# EAGLE schematic yoocnc_grbl (EAGLE 6.5.0)
DATABASE: d:/program files/eagle/parts_db/digikey_parts.txt

## Sheet 1 of 6
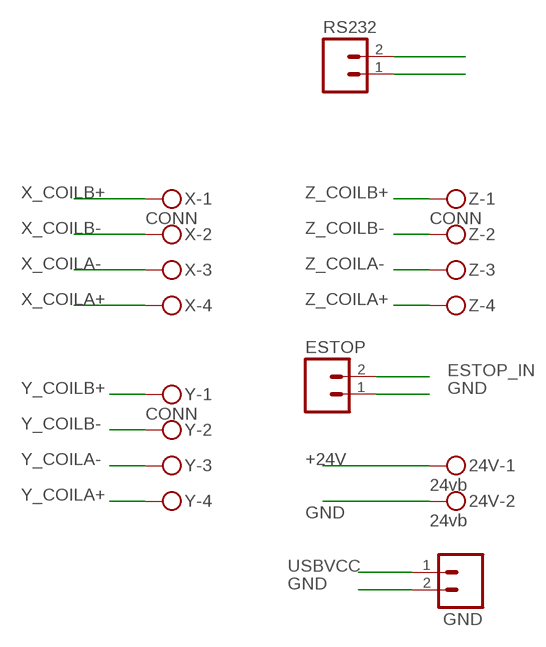
[diagram p0: schematic, sheet 1]

### Parts
24V  24vb  MKDSN1,5/2-5,08  [MKDSN1,5/2-5,08]
ESTOP  M02LOCK_LONGPADS  [1X02_LOCK_LONGPADS]
GND  M02LOCK_LONGPADS  [1X02_LOCK_LONGPADS]
RS232  M02LOCK_LONGPADS  [1X02_LOCK_LONGPADS]
X  CONN  MKDSN1,5/4-5,08  [MKDSN1,5/4-5,08]
Y  CONN  MKDSN1,5/4-5,08  [MKDSN1,5/4-5,08]
Z  CONN  MKDSN1,5/4-5,08  [MKDSN1,5/4-5,08]

### Nets
+24V [power]: 24V.1 ; also sheet 2
ESTOP_IN: ESTOP.2 ; also sheet 6
GND [power]: 24V.2 ESTOP.1 GND.2 ; also sheet 2,3,4,5,6
RXD2: RS232.1 ; also sheet 6
TXD2: RS232.2 ; also sheet 6
USBVCC [usbvcc]: GND.1 ; also sheet 2,5,6
X_COILA+ [gnd]: X.4 ; also sheet 2
X_COILA- [gnd]: X.3 ; also sheet 2
X_COILB+ [gnd]: X.1 ; also sheet 2
X_COILB- [gnd]: X.2 ; also sheet 2
Y_COILA+ [gnd]: Y.4 ; also sheet 3
Y_COILA- [gnd]: Y.3 ; also sheet 3
Y_COILB+ [gnd]: Y.1 ; also sheet 3
Y_COILB- [gnd]: Y.2 ; also sheet 3
Z_COILA+ [gnd]: Z.4 ; also sheet 4
Z_COILA- [gnd]: Z.3 ; also sheet 4
Z_COILB+ [gnd]: Z.1 ; also sheet 4
Z_COILB- [gnd]: Z.2 ; also sheet 4

## Sheet 2 of 6
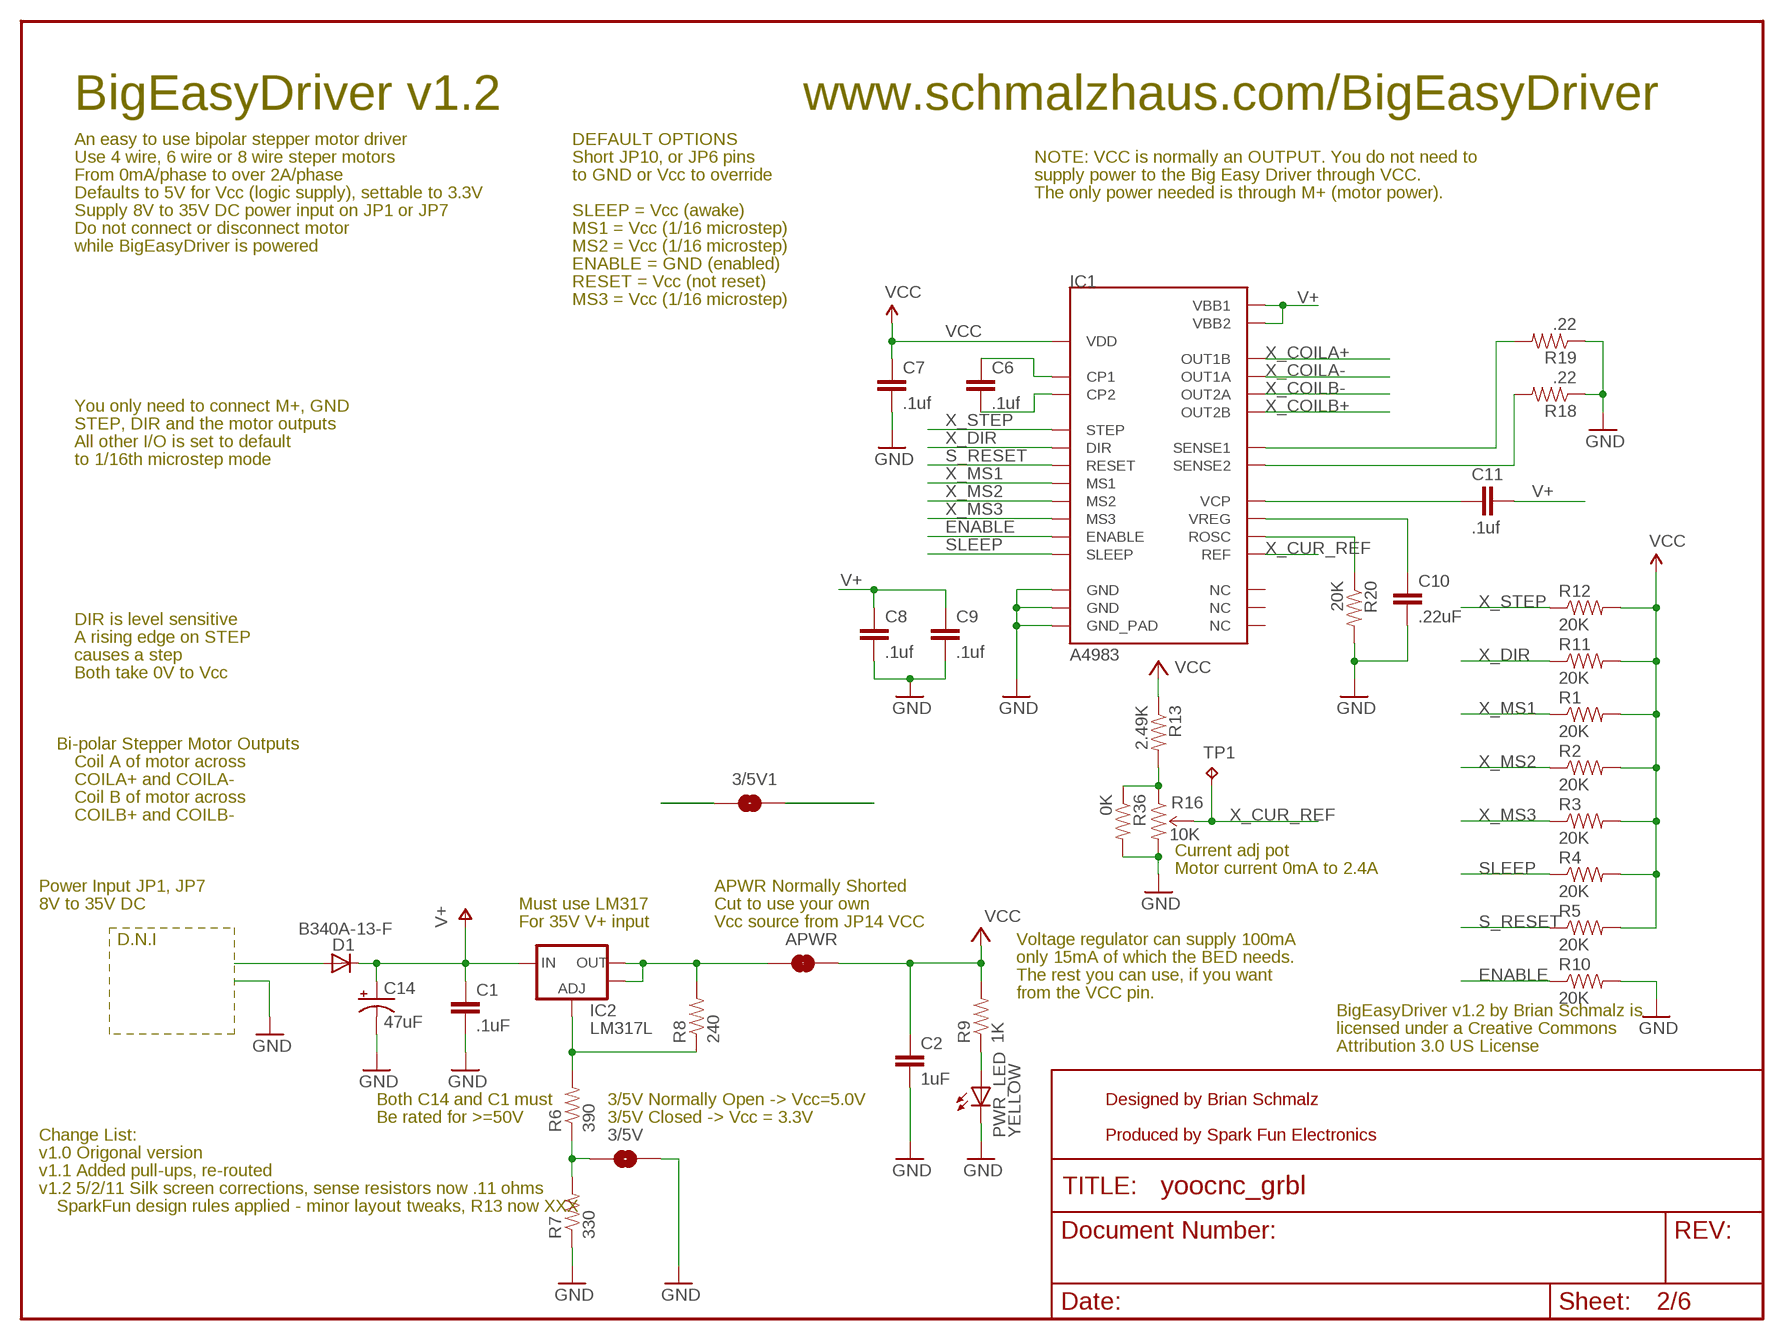
[diagram p1: schematic, sheet 2]

### Parts
3/5V  SOLDERJUMPERNO  [SJ_2S-NO]
3/5V1  SOLDERJUMPERNO  [SJ_2S-NO]
APWR  SOLDERJUMPERTRACE  [SJ_2S-TRACE]
C1  .1uF  CAP1206  [1206]
C2  1uF  CAP0402-CAP  [0402-CAP]
C6  .1uf  CAP0402-CAP  [0402-CAP]
C7  .1uf  CAP0402-CAP  [0402-CAP]
C8  .1uf  CAP0402-CAP  [0402-CAP]
C9  .1uf  CAP0402-CAP  [0402-CAP]
C10  .22uF  CAP0402-CAP  [0402-CAP]
C11  .1uf  CAP0402-CAP  [0402-CAP]
C14  47uF  CAP_POLD  [PANASONIC_D]
D1  B340A-13-F  DIODE-DO-214AC  [DO-214AC]
IC1  A4983  [QFN-28-5MM]
IC2  LM317L  SPARKFUN03_30_09_V_REG_317SOT89SOT89  [SCHMALZHAUS_SOT89]
PWR_LED  YELLOW  LED0603  [LED-0603]
R1  20K  RESISTOR0402-RES  [0402-RES]
R2  20K  RESISTOR0402-RES  [0402-RES]
R3  20K  RESISTOR0402-RES  [0402-RES]
R4  20K  RESISTOR0402-RES  [0402-RES]
R5  20K  RESISTOR0402-RES  [0402-RES]
R6  390  RESISTOR0402-RES  [0402-RES]
R7  330  RESISTOR0402-RES  [0402-RES]
R8  240  RESISTOR0402-RES  [0402-RES]
R9  1K  RESISTOR0402-RES  [0402-RES]
R10  20K  RESISTOR0402-RES  [0402-RES]
R11  20K  RESISTOR0402-RES  [0402-RES]
R12  20K  RESISTOR0402-RES  [0402-RES]
R13  2.49K  RESISTOR0402-RES  [0402-RES]
R16  10K  TRIMPOT-PTH-KNOB  [3386U]
R18  .22  RESISTOR2010  [R2010]
R19  .22  RESISTOR2010  [R2010]
R20  20K  RESISTOR0402-RES  [0402-RES]
R36  0K  RESISTOR0402-RES  [0402-RES]
TP1  TPPAD1-13  [P1-13]

### Nets
+24V [power]: D1.A ; also sheet 1
ENABLE: IC1.P$2(ENABLE) R10.1 ; also sheet 3,4,6
GND [power]: 3/5V.2 C1.2 C2.2 C7.2 C8.2 C9.2 C10.2 C14.- IC1.P$3(GND) IC1.P$18(GND) IC1.P$29(GND_PAD) PWR_LED.C R7.1 R10.2 R16.3(CW) R18.1 R19.1 R20.2 R36.2 ; also sheet 1,3,4,5,6
N$2: PWR_LED.A R9.1
N$3: R13.2 R16.1(CCW) R36.1
N$4: 3/5V.1 R6.1 R7.2
N$6: IC2.ADJ R6.2 R8.1
N$8: C6.1 IC1.P$4(CP1)
N$9: C6.2 IC1.P$5(CP2)
N$19: IC1.P$13(ROSC) R20.1
N$20: C10.1 IC1.P$8(VREG)
N$21: C11.1 IC1.P$6(VCP)
N$31: IC1.P$27(SENSE2) R18.2
N$32: IC1.P$23(SENSE1) R19.2
S_RESET: IC1.P$12(RESET) R5.1 ; also sheet 3,4,6
SLEEP: IC1.P$14(SLEEP) R4.1 ; also sheet 3,4,6
USBVCC [usbvcc]: 3/5V1.1 ; also sheet 1,5,6
V+ [power]: C1.1 C8.1 C9.1 C11.2 C14.+ D1.C IC1.P$22(VBB1) IC1.P$28(VBB2) IC2.IN ; also sheet 3,4
VCC: 3/5V1.2 APWR.2 C2.1 C7.1 IC1.P$15(VDD) R1.2 R2.2 R3.2 R4.2 R5.2 R9.2 R11.2 R12.2 R13.1 ; also sheet 3,4
X_5V_ALT [power]: APWR.1 IC2.OUT IC2.OUT@1(OUT) R8.2
X_COILA+ [gnd]: IC1.P$21(OUT1B) ; also sheet 1
X_COILA- [gnd]: IC1.P$24(OUT1A) ; also sheet 1
X_COILB+ [gnd]: IC1.P$1(OUT2B) ; also sheet 1
X_COILB- [gnd]: IC1.P$26(OUT2A) ; also sheet 1
X_CUR_REF: IC1.P$17(REF) R16.2(WIPER) TP1.TP
X_DIR: IC1.P$19(DIR) R11.1 ; also sheet 6
X_MS1: IC1.P$9(MS1) R1.1 ; also sheet 6
X_MS2: IC1.P$10(MS2) R2.1 ; also sheet 6
X_MS3: IC1.P$11(MS3) R3.1 ; also sheet 6
X_STEP: IC1.P$16(STEP) R12.1 ; also sheet 6
Unconnected: IC1.P$7(NC) IC1.P$20(NC) IC1.P$25(NC)

### Notes on the sheet
- BigEasyDriver v1.2 | www.schmalzhaus.com/BigEasyDriver
- An easy to use bipolar stepper motor driver | DEFAULT OPTIONS
- Use 4 wire, 6 wire or 8 wire steper motors | Short JP10, or JP6 pins | NOTE: VCC is normally an OUTPUT. You do not need to
- From 0mA/phase to over 2A/phase | to GND or Vcc to override | supply power to the Big Easy Driver through VCC.
- Defaults to 5V for Vcc (logic supply), settable to 3.3V | The only power needed is through M+ (motor power).
- Supply 8V to 35V DC power input on JP1 or JP7 | SLEEP = Vcc (awake)
- Do not connect or disconnect motor | MS1 = Vcc (1/16 microstep)
- while BigEasyDriver is powered | MS2 = Vcc (1/16 microstep)
- ENABLE = GND (enabled)
- RESET = Vcc (not reset)
- MS3 = Vcc (1/16 microstep)
- You only need to connect M+, GND
- STEP, DIR and the motor outputs
- All other I/O is set to default
- to 1/16th microstep mode
- DIR is level sensitive
- A rising edge on STEP
- causes a step
- Both take 0V to Vcc
- Bi-polar Stepper Motor Outputs
- Coil A of motor across
- COILA+ and COILA-
- Coil B of motor across
- COILB+ and COILB-
- Current adj pot
- Motor current 0mA to 2.4A
- Power Input JP1, JP7 | APWR Normally Shorted
- 8V to 35V DC | Must use LM317 | Cut to use your own
- For 35V V+ input | Vcc source from JP14 VCC
- D.N.I | Voltage regulator can supply 100mA
- only 15mA of which the BED needs.
- The rest you can use, if you want
- from the VCC pin.
- BigEasyDriver v1.2 by Brian Schmalz is
- licensed under a Creative Commons
- Attribution 3.0 US License
- Both C14 and C1 must | 3/5V Normally Open -> Vcc=5.0V | Designed by Brian Schmalz
- Be rated for >=50V | 3/5V Closed -> Vcc = 3.3V
- Change List: | Produced by Spark Fun Electronics
- v1.0 Origonal version
- v1.1 Added pull-ups, re-routed
- v1.2 5/2/11 Silk screen corrections, sense resistors now .11 ohms
- SparkFun design rules applied - minor layout tweaks, R13 now XXX

## Sheet 3 of 6
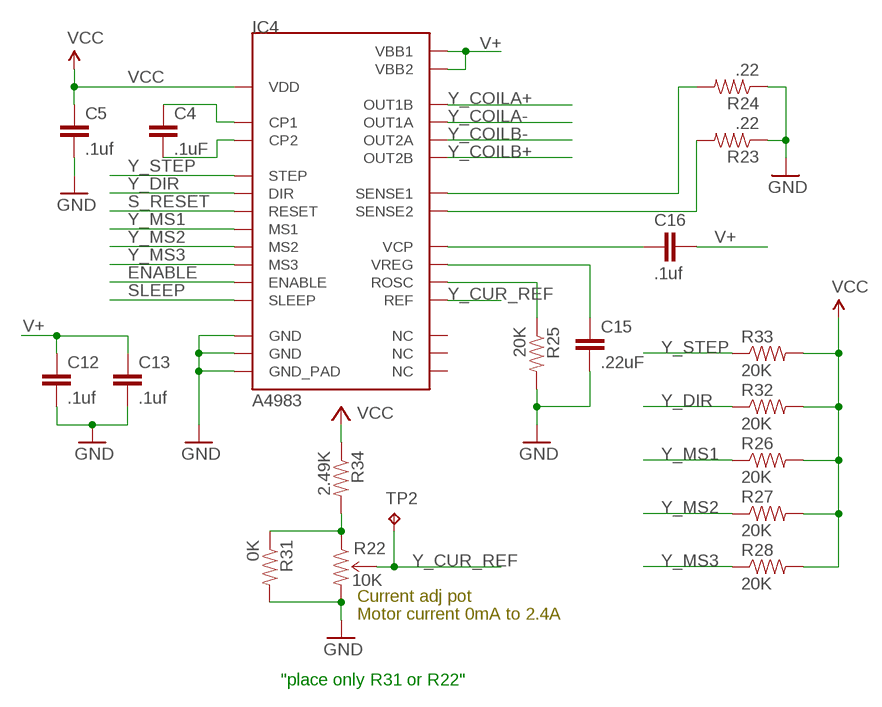
[diagram p2: schematic, sheet 3]

### Parts
C4  .1uF  CAP0402-CAP  [0402-CAP]
C5  .1uf  CAP0402-CAP  [0402-CAP]
C12  .1uf  CAP0402-CAP  [0402-CAP]
C13  .1uf  CAP0402-CAP  [0402-CAP]
C15  .22uF  CAP0402-CAP  [0402-CAP]
C16  .1uf  CAP0402-CAP  [0402-CAP]
IC4  A4983  [QFN-28-5MM]
R22  10K  TRIMPOT-PTH-KNOB  [3386U]
R23  .22  RESISTOR2010  [R2010]
R24  .22  RESISTOR2010  [R2010]
R25  20K  RESISTOR0402-RES  [0402-RES]
R26  20K  RESISTOR0402-RES  [0402-RES]
R27  20K  RESISTOR0402-RES  [0402-RES]
R28  20K  RESISTOR0402-RES  [0402-RES]
R31  0K  RESISTOR0402-RES  [0402-RES]
R32  20K  RESISTOR0402-RES  [0402-RES]
R33  20K  RESISTOR0402-RES  [0402-RES]
R34  2.49K  RESISTOR0402-RES  [0402-RES]
TP2  TPPAD1-13  [P1-13]

### Nets
ENABLE: IC4.P$2(ENABLE) ; also sheet 2,4,6
GND [power]: C5.2 C12.2 C13.2 C15.2 IC4.P$3(GND) IC4.P$18(GND) IC4.P$29(GND_PAD) R22.3(CW) R23.1 R24.1 R25.2 R31.2 ; also sheet 1,2,4,5,6
N$11: IC4.P$27(SENSE2) R23.2
N$12: IC4.P$23(SENSE1) R24.2
N$13: C4.1 IC4.P$4(CP1)
N$14: C4.2 IC4.P$5(CP2)
N$15: IC4.P$13(ROSC) R25.1
N$16: C15.1 IC4.P$8(VREG)
N$17: C16.1 IC4.P$6(VCP)
N$22: R22.1(CCW) R31.1 R34.2
S_RESET: IC4.P$12(RESET) ; also sheet 2,4,6
SLEEP: IC4.P$14(SLEEP) ; also sheet 2,4,6
V+ [power]: C12.1 C13.1 C16.2 IC4.P$22(VBB1) IC4.P$28(VBB2) ; also sheet 2,4
VCC: C5.1 IC4.P$15(VDD) R26.2 R27.2 R28.2 R32.2 R33.2 R34.1 ; also sheet 2,4
Y_COILA+ [gnd]: IC4.P$21(OUT1B) ; also sheet 1
Y_COILA- [gnd]: IC4.P$24(OUT1A) ; also sheet 1
Y_COILB+ [gnd]: IC4.P$1(OUT2B) ; also sheet 1
Y_COILB- [gnd]: IC4.P$26(OUT2A) ; also sheet 1
Y_CUR_REF: IC4.P$17(REF) R22.2(WIPER) TP2.TP
Y_DIR: IC4.P$19(DIR) R32.1 ; also sheet 6
Y_MS1: IC4.P$9(MS1) R26.1 ; also sheet 6
Y_MS2: IC4.P$10(MS2) R27.1 ; also sheet 6
Y_MS3: IC4.P$11(MS3) R28.1 ; also sheet 6
Y_STEP: IC4.P$16(STEP) R33.1 ; also sheet 6
Unconnected: IC4.P$7(NC) IC4.P$20(NC) IC4.P$25(NC)

### Notes on the sheet
- Current adj pot
- Motor current 0mA to 2.4A
- "place only R31 or R22"

## Sheet 4 of 6
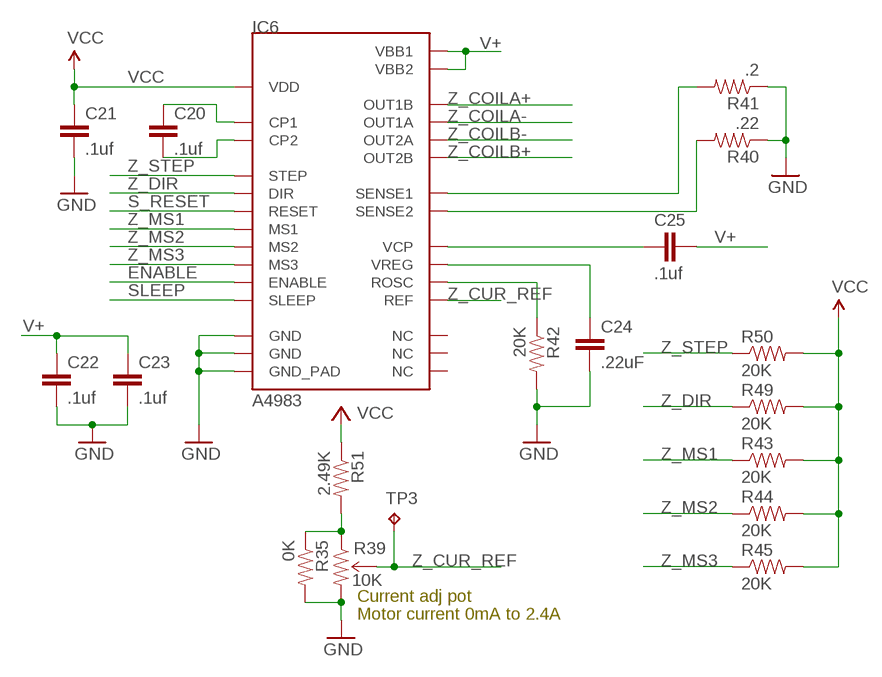
[diagram p3: schematic, sheet 4]

### Parts
C20  .1uf  CAP0402-CAP  [0402-CAP]
C21  .1uf  CAP0402-CAP  [0402-CAP]
C22  .1uf  CAP0402-CAP  [0402-CAP]
C23  .1uf  CAP0402-CAP  [0402-CAP]
C24  .22uF  CAP0402-CAP  [0402-CAP]
C25  .1uf  CAP0402-CAP  [0402-CAP]
IC6  A4983  [QFN-28-5MM]
R35  0K  RESISTOR0402-RES  [0402-RES]
R39  10K  TRIMPOT-PTH-KNOB  [3386U]
R40  .22  RESISTOR2010  [R2010]
R41  .2  RESISTOR2010  [R2010]
R42  20K  RESISTOR0402-RES  [0402-RES]
R43  20K  RESISTOR0402-RES  [0402-RES]
R44  20K  RESISTOR0402-RES  [0402-RES]
R45  20K  RESISTOR0402-RES  [0402-RES]
R49  20K  RESISTOR0402-RES  [0402-RES]
R50  20K  RESISTOR0402-RES  [0402-RES]
R51  2.49K  RESISTOR0402-RES  [0402-RES]
TP3  TPPAD1-13  [P1-13]

### Nets
ENABLE: IC6.P$2(ENABLE) ; also sheet 2,3,6
GND [power]: C21.2 C22.2 C23.2 C24.2 IC6.P$3(GND) IC6.P$18(GND) IC6.P$29(GND_PAD) R35.2 R39.3(CW) R40.1 R41.1 R42.2 ; also sheet 1,2,3,5,6
N$26: IC6.P$27(SENSE2) R40.2
N$27: IC6.P$23(SENSE1) R41.2
N$28: C20.1 IC6.P$4(CP1)
N$29: C20.2 IC6.P$5(CP2)
N$30: IC6.P$13(ROSC) R42.1
N$33: C24.1 IC6.P$8(VREG)
N$34: C25.1 IC6.P$6(VCP)
N$36: R35.1 R39.1(CCW) R51.2
S_RESET: IC6.P$12(RESET) ; also sheet 2,3,6
SLEEP: IC6.P$14(SLEEP) ; also sheet 2,3,6
V+ [power]: C22.1 C23.1 C25.2 IC6.P$22(VBB1) IC6.P$28(VBB2) ; also sheet 2,3
VCC: C21.1 IC6.P$15(VDD) R43.2 R44.2 R45.2 R49.2 R50.2 R51.1 ; also sheet 2,3
Z_COILA+ [gnd]: IC6.P$21(OUT1B) ; also sheet 1
Z_COILA- [gnd]: IC6.P$24(OUT1A) ; also sheet 1
Z_COILB+ [gnd]: IC6.P$1(OUT2B) ; also sheet 1
Z_COILB- [gnd]: IC6.P$26(OUT2A) ; also sheet 1
Z_CUR_REF: IC6.P$17(REF) R39.2(WIPER) TP3.TP
Z_DIR: IC6.P$19(DIR) R49.1 ; also sheet 6
Z_MS1: IC6.P$9(MS1) R43.1 ; also sheet 6
Z_MS2: IC6.P$10(MS2) R44.1 ; also sheet 6
Z_MS3: IC6.P$11(MS3) R45.1 ; also sheet 6
Z_STEP: IC6.P$16(STEP) R50.1 ; also sheet 6
Unconnected: IC6.P$7(NC) IC6.P$20(NC) IC6.P$25(NC)

### Notes on the sheet
- Current adj pot
- Motor current 0mA to 2.4A

## Sheet 5 of 6
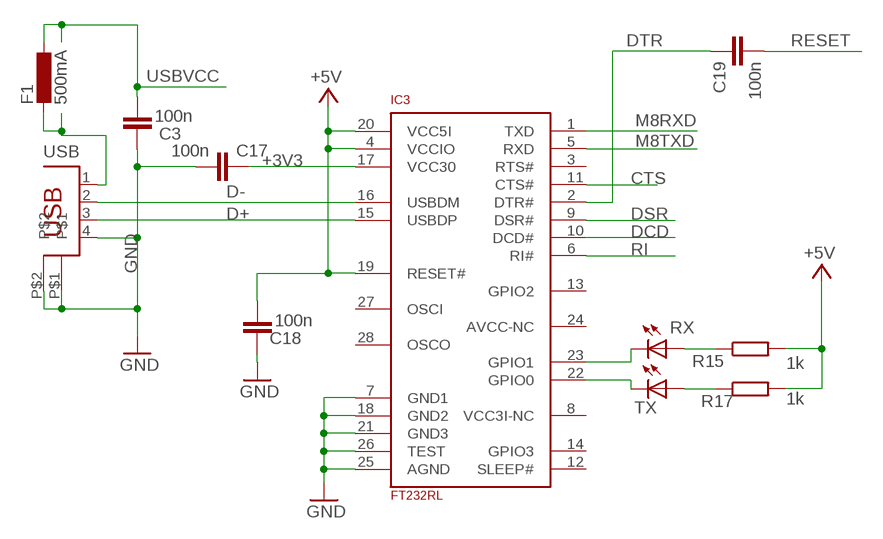
[diagram p4: schematic, sheet 5]

### Parts
C3  100n  C-EUC0805K  [C0805K]
C17  100n  C-EUC0805K  [C0805K]
C18  100n  C-EUC0805K  [C0805K]
C19  100n  C-EUC0805K  [C0805K]
F1  500mA  L-EUL1812  [L1812]
IC3  FT232RL  [SSOP28]
R15  1k  R-EU_R0805W  [R0805W]
R17  1k  R-EU_R0805W  [R0805W]
RX  LEDCHIP-LED0805  [CHIP-LED0805]
TX  LEDCHIP-LED0805  [CHIP-LED0805]
USB  PN61729  [PN61729]

### Nets
+3V3 [power]: C17.2 IC3.17(VCC30)
CTS: IC3.11(CTS#)
D+: IC3.15(USBDP) USB.3
D-: IC3.16(USBDM) USB.2
DCD: IC3.10(DCD#)
DSR: IC3.9(DSR#)
DTR: C19.1 IC3.2(DTR#)
GND [power]: C3.2 C17.1 C18.2 IC3.7(GND1) IC3.18(GND2) IC3.21(GND3) IC3.25(AGND) IC3.26(TEST) USB.4 USB.P$1 USB.P$2 ; also sheet 1,2,3,4,6
M8RXD: IC3.1(TXD) ; also sheet 6
M8TXD: IC3.5(RXD) ; also sheet 6
N$52: IC3.23(GPIO1) RX.C
N$53: IC3.22(GPIO0) TX.C
N$54: R15.1 RX.A
N$55: R17.1 TX.A
N$60 [usbvcc]: F1.2 USB.1
RESET: C19.2 ; also sheet 6
RI: IC3.6(RI#)
USBVCC [usbvcc]: C3.1 C18.1 F1.1 IC3.4(VCCIO) IC3.19(RESET#) IC3.20(VCC5I) R15.2 R17.2 ; supply symbol labelled +5V ; also sheet 1,2,6
Unconnected: IC3.3(RTS#) IC3.8(VCC3I-NC) IC3.12(SLEEP#) IC3.13(GPIO2) IC3.14(GPIO3) IC3.24(AVCC-NC) IC3.27(OSCI) IC3.28(OSCO)

## Sheet 6 of 6
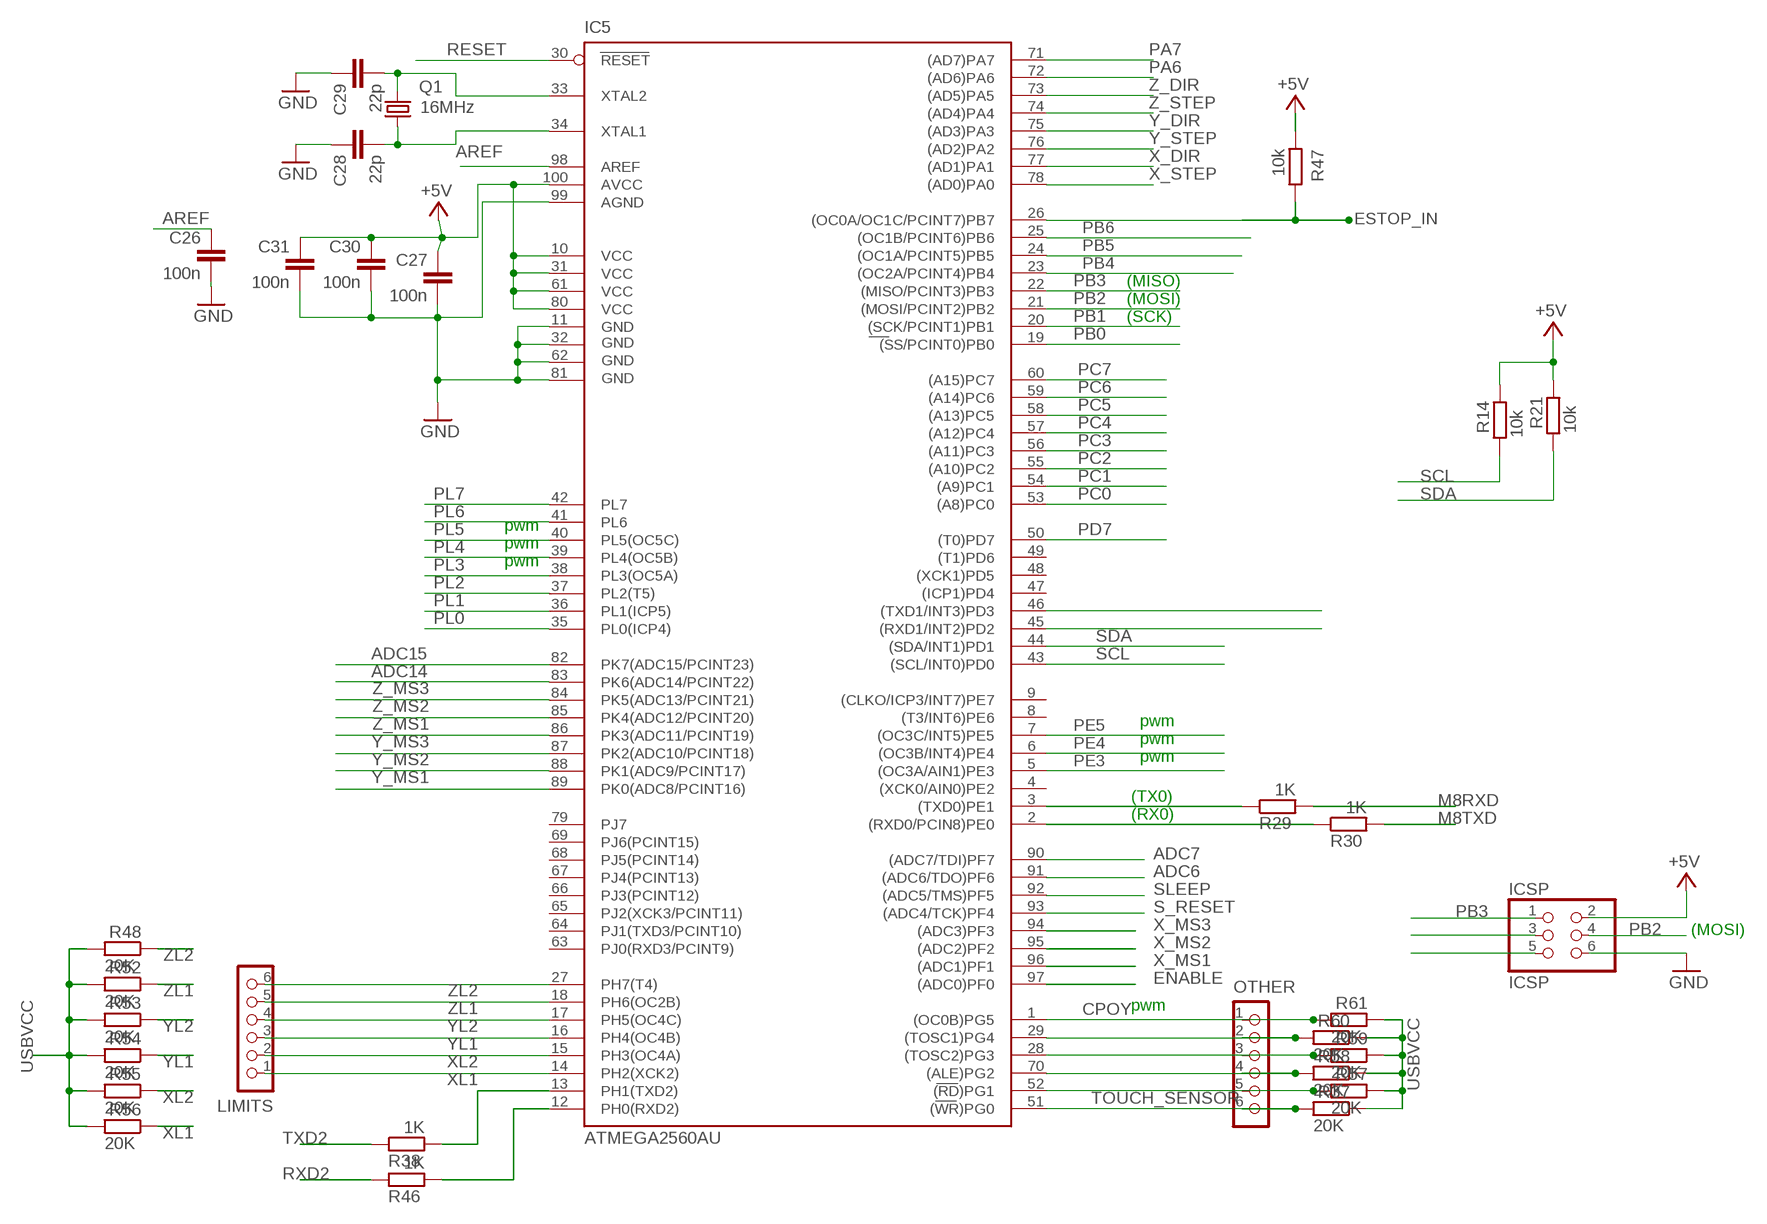
[diagram p5: schematic, sheet 6]

### Parts
C26  100n  C-EUC0805K  [C0805K]
C27  100n  C-EUC0805K  [C0805K]
C28  22p  C-EUC0805K  [C0805K]
C29  22p  C-EUC0805K  [C0805K]
C30  100n  C-EUC0805K  [C0805K]
C31  100n  C-EUC0805K  [C0805K]
IC5  ATMEGA2560AU  [TQFP100]
ICSP  ICSP  PINHD-2X3  [2X03]
LIMITS  CON_HEADER_1X06-PTH  [M1X6]
OTHER  CON_HEADER_1X06-PTH  [M1X6]
Q1  16MHz  CRYTALSM49  [SM49]
R14  10k  R-EU_R0805W  [R0805W]
R21  10k  R-EU_R0805W  [R0805W]
R29  1K  R-EU_R0805W  [R0805W]
R30  1K  R-EU_R0805W  [R0805W]
R37  20K  R-EU_R0603  [R0603]
R38  1K  R-EU_R0805W  [R0805W]
R46  1K  R-EU_R0805W  [R0805W]
R47  10k  R-EU_R0805W  [R0805W]
R48  20K  R-EU_R0603  [R0603]
R52  20K  R-EU_R0603  [R0603]
R53  20K  R-EU_R0603  [R0603]
R54  20K  R-EU_R0603  [R0603]
R55  20K  R-EU_R0603  [R0603]
R56  20K  R-EU_R0603  [R0603]
R57  20K  R-EU_R0603  [R0603]
R58  20K  R-EU_R0603  [R0603]
R59  20K  R-EU_R0603  [R0603]
R60  20K  R-EU_R0603  [R0603]
R61  20K  R-EU_R0603  [R0603]

### Nets
ADC6: IC5.91((ADC6/TDO)PF6)
ADC7: IC5.90((ADC7/TDI)PF7)
ADC14: IC5.83(PK6(ADC14/PCINT22))
ADC15: IC5.82(PK7(ADC15/PCINT23))
AREF: C26.1 IC5.98(AREF)
CPOY: IC5.1((OC0B)PG5) OTHER.1 R61.2
ENABLE: IC5.97((ADC0)PF0) ; also sheet 2,3,4
ESTOP_IN: IC5.26((OC0A/OC1C/PCINT7)PB7) R47.1 ; also sheet 1
GND [power]: C26.2 C27.2 C28.1 C29.1 C30.2 C31.2 IC5.11(GND) IC5.32(GND1) IC5.62(GND2) IC5.81(GND3) IC5.99(AGND) ICSP.6 ; also sheet 1,2,3,4,5
M8RXD: R29.2 ; also sheet 5
M8TXD: R30.2 ; also sheet 5
N$1: IC5.29((TOSC1)PG4) OTHER.2 R60.2
N$5: IC5.28((TOSC2)PG3) OTHER.3 R59.2
N$7: IC5.3((TXD0)PE1) R29.1
N$10: IC5.2((RXD0/PCIN8)PE0) R30.1
N$18: IC5.70((ALE)PG2) OTHER.4 R58.2
N$23: IC5.52((RD)PG1) OTHER.5 R57.2
N$24: IC5.13(PH1(TXD2)) R38.2
N$25: IC5.12(PH0(RXD2)) R46.2
N$56: C28.2 IC5.34(XTAL1)
N$57: C29.2 IC5.33(XTAL2)
PA6: IC5.72((AD6)PA6)
PA7: IC5.71((AD7)PA7)
PB0: IC5.19((SS/PCINT0)PB0)
PB1: IC5.20((SCK/PCINT1)PB1) ICSP.3
PB2: IC5.21((MOSI/PCINT2)PB2) ICSP.4
PB3: IC5.22((MISO/PCINT3)PB3) ICSP.1
PB4: IC5.23((OC2A/PCINT4)PB4)
PB5: IC5.24((OC1A/PCINT5)PB5)
PB6: IC5.25((OC1B/PCINT6)PB6)
PC0: IC5.53((A8)PC0)
PC1: IC5.54((A9)PC1)
PC2: IC5.55((A10)PC2)
PC3: IC5.56((A11)PC3)
PC4: IC5.57((A12)PC4)
PC5: IC5.58((A13)PC5)
PC6: IC5.59((A14)PC6)
PC7: IC5.60((A15)PC7)
PD7: IC5.50((T0)PD7)
PE3: IC5.5((OC3A/AIN1)PE3)
PE4: IC5.6((OC3B/INT4)PE4)
PE5: IC5.7((OC3C/INT5)PE5)
PL0: IC5.35(PL0(ICP4))
PL1: IC5.36(PL1(ICP5))
PL2: IC5.37(PL2(T5))
PL3: IC5.38(PL3(OC5A))
PL4: IC5.39(PL4(OC5B))
PL5: IC5.40(PL5(OC5C))
PL6: IC5.41(PL6)
PL7: IC5.42(PL7)
RESET: IC5.30(RESET) ICSP.5 ; also sheet 5
RXD1: IC5.45((RXD1/INT2)PD2)
RXD2: R46.1 ; also sheet 1
S_RESET: IC5.93((ADC4/TCK)PF4) ; also sheet 2,3,4
SCL: IC5.43((SCL/INT0)PD0) R14.2
SDA: IC5.44((SDA/INT1)PD1) R21.2
SLEEP: IC5.92((ADC5/TMS)PF5) ; also sheet 2,3,4
TOUCH_SENSOR: IC5.51((WR)PG0) OTHER.6 R37.2
TXD1: IC5.46((TXD1/INT3)PD3)
TXD2: R38.1 ; also sheet 1
USBVCC [usbvcc]: C27.1 C30.1 C31.1 IC5.10(VCC) IC5.31(VCC1) IC5.61(VCC2) IC5.80(VCC3) IC5.100(AVCC) ICSP.2 R14.1 R21.1 R37.1 R47.2 R48.2 R52.2 R53.2 R54.2 R55.2 R56.2 R57.1 R58.1 R59.1 R60.1 R61.1 ; supply symbol labelled +5V ; also sheet 1,2,5
X_DIR: IC5.77((AD1)PA1) ; also sheet 2
X_MS1: IC5.96((ADC1)PF1) ; also sheet 2
X_MS2: IC5.95((ADC2)PF2) ; also sheet 2
X_MS3: IC5.94((ADC3)PF3) ; also sheet 2
X_STEP: IC5.78((AD0)PA0) ; also sheet 2
XL1: IC5.14(PH2(XCK2)) LIMITS.1 R56.1
XL2: IC5.15(PH3(OC4A)) LIMITS.2 R55.1
Y_DIR: IC5.75((AD3)PA3) ; also sheet 3
Y_MS1: IC5.89(PK0(ADC8/PCINT16)) ; also sheet 3
Y_MS2: IC5.88(PK1(ADC9/PCINT17)) ; also sheet 3
Y_MS3: IC5.87(PK2(ADC10/PCINT18)) ; also sheet 3
Y_STEP: IC5.76((AD2)PA2) ; also sheet 3
YL1: IC5.16(PH4(OC4B)) LIMITS.3 R54.1
YL2: IC5.17(PH5(OC4C)) LIMITS.4 R53.1
Z_DIR: IC5.73((AD5)PA5) ; also sheet 4
Z_MS1: IC5.86(PK3(ADC11/PCINT19)) ; also sheet 4
Z_MS2: IC5.85(PK4(ADC12/PCINT20)) ; also sheet 4
Z_MS3: IC5.84(PK5(ADC13/PCINT21)) ; also sheet 4
Z_STEP: IC5.74((AD4)PA4) ; also sheet 4
ZL1: IC5.18(PH6(OC2B)) LIMITS.5 R52.1
ZL2: IC5.27(PH7(T4)) LIMITS.6 R48.1
Unconnected: IC5.4((XCK0/AIN0)PE2) IC5.8((T3/INT6)PE6) IC5.9((CLKO/ICP3/INT7)PE7) IC5.47((ICP1)PD4) IC5.48((XCK1)PD5) IC5.49((T1)PD6) IC5.63(PJ0(RXD3/PCINT9)) IC5.64(PJ1(TXD3/PCINT10)) IC5.65(PJ2(XCK3/PCINT11)) IC5.66(PJ3(PCINT12)) IC5.67(PJ4(PCINT13)) IC5.68(PJ5(PCINT14)) IC5.69(PJ6(PCINT15)) IC5.79(PJ7) Q1.1 Q1.2

### Notes on the sheet
- (MISO)
- (MOSI)
- (SCK)
- pwm
- pwm
- pwm
- pwm
- pwm
- pwm
- (TX0)
- (RX0)
- (MOSI)
- pwm

## Library data of the parts
3/5V 3/5V1 APWR = SparkFun03_30_09:SOLDERJUMPER: Solder Jumper Standard SMD solder jumper. Used to automate production. Two varients : Normally Open and Normally Closed are the same, but have different paste layers. NC will have a large amount of paste and should jumper during reflow.; BOM: EXCLUDE
24V = con-phoenix-508:MKDSN1,5/2-5,08: MKDSN 1,5/ 2-5,08 Printklemme Nennstrom: 13,5 A Nennspannung: 250 V Rastermaß: 5,08 mm Polzahl: 2 Anschlussart: Schraubanschluss Montage: Löten Anschlussrichtung Leiter/Platine: 0 ° Artikelnummer: 1729128 Source: http://eshop.phoenixcontact.com .. 1729128.pdf; BOM: INCLUDE; MPN: MKDSN 1,5/2-5.08; OC_FARNELL: 1792903; OC_NEWARK: 30M2397; PARTNO: 0010321021
C1 C4-C9 C11-C13 C16 C20-C23 C25 = SparkFun:CAP: Capacitor Standard 0402 ceramic capacitor, and 0.1" leaded capacitor.; PARTNO: LMK105BJ104KV-F
C2 = SparkFun:CAP: Capacitor Standard 0402 ceramic capacitor, and 0.1" leaded capacitor.; PARTNO: JMK105BJ105KV-F
C3 C17-C19 C26 C27 C30 C31 = resistor:C-EU: CAPACITOR, European symbol; PARTNO: CC0805ZRY5V9BB104
C10 C15 C24 = SparkFun:CAP: Capacitor Standard 0402 ceramic capacitor, and 0.1" leaded capacitor.; PARTNO: C1005Y5V1C224Z
C14 = SparkFun:CAP_POL: Capacitor Polarized These are standard SMD and PTH capacitors. Normally 10uF, 47uF, and 100uF in electrolytic and tantalum varieties. Always verify the external diameter of the through hole cap, it varies with capacity, voltage, and manufacturer. The EIA devices should be standard.; PARTNO: EEE-FP1V470AP
C28 C29 = resistor:C-EU: CAPACITOR, European symbol; PARTNO: C0805C220J5GACTU
D1 = diode:DIODE-: DIODE; PARTNO: B340A-13-F
ESTOP GND RS232 = SparkFun:M02: Header 2 Standard 2-pin 0.1" header. Use with straight break away headers (SKU : PRT-00116), right angle break away headers (PRT-00553), swiss pins (PRT-00743), machine pins (PRT-00117), and female headers (PRT-00115). Molex polarized connector foot print use with SKU : PRT-08233 with associated crimp pins and housings.; PARTNO: *
F1 = rcl:L-EU: INDUCTOR, European symbol; PARTNO: MINISMDC050F-2
IC1 IC4 IC6 = SparkFun:A4983: DMOS Microstepping Driver with Translator; PARTNO: A4983SETTR-T
IC2 = BigEasyDriver_v11:SPARKFUN03_30_09_V_REG_317: Voltage Regulator Standard LM317 adjustable voltage regulator. AOI (Adjust Output Input). Google LM317 Calculator' for easy to use app to get the two resistor values needed. 240/720 for 5V output. 240/390 for 3.3V output. Spark Fun Electronics SKU : COM-00527'; PARTNO: LM317LCPK
IC3 = SmartPrj:FT232RL; PARTNO: FT232RL-REEL
IC5 = SparkFun:ATMEGA2560: MICROCONTROLLER 64/128/256 Kbytes FLASH 4 Kbytes EEPROM 8 Kbytes SRAM 86 General Purpose I/O pins 12-channels16-bit PWM 4 x Serial USARTs 16-channels 10-bit A/D; PARTNO: ATMEGA256RZBV-8AU
ICSP = pinhead:PINHD-2X3: PIN HEADER; PARTNO: *
LIMITS OTHER = dp_devices:CON_HEADER_1X06; PARTNO: *
PWR_LED = SparkFun03_30_09:LED: LEDs Standard schematic elements and footprints for 5mm, 3mm, 1206, and 0603 sized LEDs. 5mm - Spark Fun Electronics SKU : COM-00529 (and others); PARTNO: LY L29K-H1K2-26-Z
Q1 = crystal:CRYTAL: CRYSTAL; PARTNO: ABLS-16.000MHZ-B4-T
R1-R5 R10-R12 R20 R25-R28 R32 R33 R42-R45 R49 R50 = SparkFun:RESISTOR: Resistor Basic schematic elements and footprints for 0603, 1206, and PTH resistors.; PARTNO: RR0510P-203-D
R6 = SparkFun:RESISTOR: Resistor Basic schematic elements and footprints for 0603, 1206, and PTH resistors.; PARTNO: RR0510P-391-D
R7 = SparkFun:RESISTOR: Resistor Basic schematic elements and footprints for 0603, 1206, and PTH resistors.; PARTNO: RR0510P-331-D
R8 = SparkFun:RESISTOR: Resistor Basic schematic elements and footprints for 0603, 1206, and PTH resistors.; PARTNO: RR0510P-241-D
R9 = SparkFun:RESISTOR: Resistor Basic schematic elements and footprints for 0603, 1206, and PTH resistors.; PARTNO: RC0402JR-071KL
R13 R31 R34-R36 R51 = SparkFun:RESISTOR: Resistor Basic schematic elements and footprints for 0603, 1206, and PTH resistors.; PARTNO: RC0402FR-072K49L
R14 R21 R29 R30 R37 R38 R46-R48 R52-R61 = resistor:R-EU_: RESISTOR, European symbol; PARTNO: RC0805JR-0710KL
R15 R17 = resistor:R-EU_: RESISTOR, European symbol; PARTNO: 1623131-1
R16 R22 R39 = SparkFun:TRIMPOT; PARTNO: TC33X-2-103E
R18 R19 R23 R24 R40 R41 = SparkFun:RESISTOR: Resistor Basic schematic elements and footprints for 0603, 1206, and PTH resistors.; PARTNO: WSL2010R1100FEA
RX = led:LED: LED OSRAM: - CHIPLED LG R971, LG N971, LY N971, LG Q971, LY Q971, LO R971, LY R971 LH N974, LH R974 LS Q976, LO Q976, LY Q976 LO Q996 - Hyper CHIPLED LW Q18S LB Q993, LB Q99A, LB R99A - SideLED LS A670, LO A670, LY A670, LG A670, LP A670 LB A673, LV A673, LT A673, LW A673 LH A674 LY A675 LS A676, LA A676, LO A676, LY A676, LW A676 LS A679, LY A679, LG A679 - Hyper Micro SIDELED® LS Y876, LA Y876, LO Y876, LY Y876 LT Y87S - SmartLED LW L88C, LW L88S LB L89C, LB L89S, LG L890 LS L89K, LO L89K, LY L89K LS L896, LA L896, LO L896, LY L896 - TOPLED LS T670, LO T670, LY T670, LG T670, LP T670 LSG T670, LSP T670, LSY T670, LOP T670, LYG T670 LG T671, LOG T671, LSG T671 LB T673, LV T673, LT T673, LW T673 LH T674 LS T676, LA T676, LO T676, LY T676, LB T676, LH T676, LSB T676, LW T676 LB T67C, LV T67C, LT T67C, LS T67K, LO T67K, LY T67K, LW E67C LS E67B, LA E67B, LO E67B, LY E67B, LB E67C, LV E67C, LT E67C LW T67C LS T679, LY T679, LG T679 LS T770, LO T770, LY T770, LG T770, LP T770 LB T773, LV T773, LT T773, LW T773 LH T774 LS E675, LA E675, LY E675, LS T675 LS T776, LA T776, LO T776, LY T776, LB T776 LHGB T686 LT T68C, LB T68C - Hyper Mini TOPLED® LB M676 - Mini TOPLED Santana® LG M470 LS M47K, LO M47K, LY M47K Source: http://www.osram.convergy.de LUXEON: - LUMILED® LXK2-PW12-R00, LXK2-PW12-S00, LXK2-PW14-U00, LXK2-PW14-V00 LXK2-PM12-R00, LXK2-PM12-S00, LXK2-PM14-U00 LXK2-PE12-Q00, LXK2-PE12-R00, LXK2-PE12-S00, LXK2-PE14-T00, LXK2-PE14-U00 LXK2-PB12-K00, LXK2-PB12-L00, LXK2-PB12-M00, LXK2-PB14-N00, LXK2-PB14-P00, LXK2-PB14-Q00 LXK2-PR12-L00, LXK2-PR12-M00, LXK2-PR14-Q00, LXK2-PR14-R00 LXK2-PD12-Q00, LXK2-PD12-R00, LXK2-PD12-S00 LXK2-PH12-R00, LXK2-PH12-S00 LXK2-PL12-P00, LXK2-PL12-Q00, LXK2-PL12-R00 Source: www.luxeon.com KINGBRIGHT: KA-3528ASYC Source: www.kingbright.com; PARTNO: LH R974-LP-1
TP1-TP3 = testpad:TP: Test pad; BOM: EXCLUDE
TX = led:LED: LED OSRAM: - CHIPLED LG R971, LG N971, LY N971, LG Q971, LY Q971, LO R971, LY R971 LH N974, LH R974 LS Q976, LO Q976, LY Q976 LO Q996 - Hyper CHIPLED LW Q18S LB Q993, LB Q99A, LB R99A - SideLED LS A670, LO A670, LY A670, LG A670, LP A670 LB A673, LV A673, LT A673, LW A673 LH A674 LY A675 LS A676, LA A676, LO A676, LY A676, LW A676 LS A679, LY A679, LG A679 - Hyper Micro SIDELED® LS Y876, LA Y876, LO Y876, LY Y876 LT Y87S - SmartLED LW L88C, LW L88S LB L89C, LB L89S, LG L890 LS L89K, LO L89K, LY L89K LS L896, LA L896, LO L896, LY L896 - TOPLED LS T670, LO T670, LY T670, LG T670, LP T670 LSG T670, LSP T670, LSY T670, LOP T670, LYG T670 LG T671, LOG T671, LSG T671 LB T673, LV T673, LT T673, LW T673 LH T674 LS T676, LA T676, LO T676, LY T676, LB T676, LH T676, LSB T676, LW T676 LB T67C, LV T67C, LT T67C, LS T67K, LO T67K, LY T67K, LW E67C LS E67B, LA E67B, LO E67B, LY E67B, LB E67C, LV E67C, LT E67C LW T67C LS T679, LY T679, LG T679 LS T770, LO T770, LY T770, LG T770, LP T770 LB T773, LV T773, LT T773, LW T773 LH T774 LS E675, LA E675, LY E675, LS T675 LS T776, LA T776, LO T776, LY T776, LB T776 LHGB T686 LT T68C, LB T68C - Hyper Mini TOPLED® LB M676 - Mini TOPLED Santana® LG M470 LS M47K, LO M47K, LY M47K Source: http://www.osram.convergy.de LUXEON: - LUMILED® LXK2-PW12-R00, LXK2-PW12-S00, LXK2-PW14-U00, LXK2-PW14-V00 LXK2-PM12-R00, LXK2-PM12-S00, LXK2-PM14-U00 LXK2-PE12-Q00, LXK2-PE12-R00, LXK2-PE12-S00, LXK2-PE14-T00, LXK2-PE14-U00 LXK2-PB12-K00, LXK2-PB12-L00, LXK2-PB12-M00, LXK2-PB14-N00, LXK2-PB14-P00, LXK2-PB14-Q00 LXK2-PR12-L00, LXK2-PR12-M00, LXK2-PR14-Q00, LXK2-PR14-R00 LXK2-PD12-Q00, LXK2-PD12-R00, LXK2-PD12-S00 LXK2-PH12-R00, LXK2-PH12-S00 LXK2-PL12-P00, LXK2-PL12-Q00, LXK2-PL12-R00 Source: www.luxeon.com KINGBRIGHT: KA-3528ASYC Source: www.kingbright.com; PARTNO: SML-211DTT86
USB = SmartPrj:PN61729: BERG USB connector; PARTNO: 61729-0010BLF
X Y Z = con-phoenix-508:MKDSN1,5/4-5,08: MKDSN 1,5/ 4-5,08 Printklemme Nennstrom: 13,5 A Nennspannung: 250 V Rastermaß: 5,08 mm Polzahl: 4 Anschlussart: Schraubanschluss Montage: Löten Anschlussrichtung Leiter/Platine: 0 ° Artikelnummer: 1729144 Source: http://eshop.phoenixcontact.com .. 1729144.pdf; MPN: SMKDSN1,5/4-5,08; OC_FARNELL: 1792905; OC_NEWARK: 70R0300; PARTNO: 0010321041

## Net classes
0 default: width 0.305 mm, drill 0.305 mm, clearance 0.152 mm
1 power: width 0.152 mm, drill 0.305 mm, clearance 0.152 mm
2 gnd: width 0.152 mm, drill 0.305 mm, clearance 0.152 mm
3 usbvcc: width 0.508 mm, drill 0.305 mm, clearance 0.152 mm